# Altium schematic sheet QCLogic Rev A Sht3 GPS.SchDoc
size A4
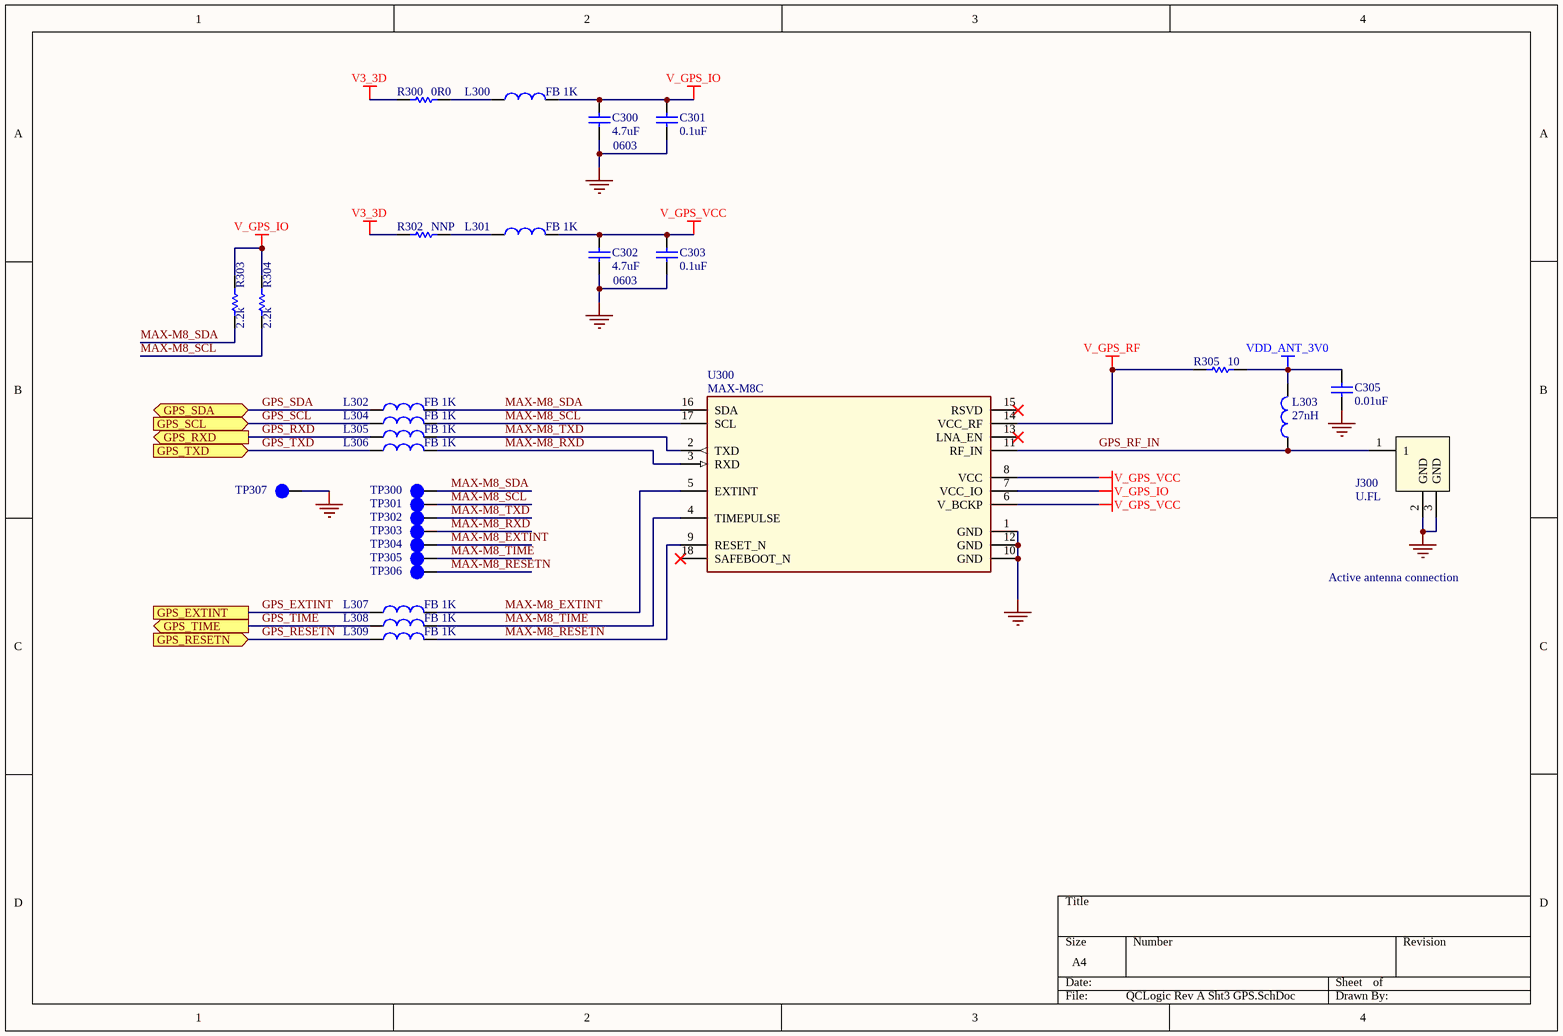
[diagram p0: QCLogic Rev A Sht3 GPS.SchDoc]

## Parts
C300  4.7uF  4. Package: 0603  [SMD CAP 0603]
C301  0.1uF  [SMD CAP 0402]
C302  4.7uF  4. Package: 0603  [SMD CAP 0603]
C303  0.1uF  [SMD CAP 0402]
C305  0.01uF  [SMD CAP 0402]
J300  U.FL  [U.FL]
L300  FB 1K  [SMD RES 0402]
L301  FB 1K  [SMD RES 0402]
L302  FB 1K  [SMD RES 0402]
L303  27nH  [SMD RES 0402]
L304  FB 1K  [SMD RES 0402]
L305  FB 1K  [SMD RES 0402]
L306  FB 1K  [SMD RES 0402]
L307  FB 1K  [SMD RES 0402]
L308  FB 1K  [SMD RES 0402]
L309  FB 1K  [SMD RES 0402]
R300  0R0  [SMD RES 0402]
R302  NNP  [SMD RES 0402]  (no BOM)
R303  2.2k  [SMD RES 0402]
R304  2.2k  [SMD RES 0402]
R305  10  [SMD RES 0402]
TP300  TESTPOINT SMD  [TESTPOINT 0.5mm DIA]  (value not drawn)  (no BOM)
TP301  TESTPOINT SMD  [TESTPOINT 0.5mm DIA]  (value not drawn)  (no BOM)
TP302  TESTPOINT SMD  [TESTPOINT 0.5mm DIA]  (value not drawn)  (no BOM)
TP303  TESTPOINT SMD  [TESTPOINT 0.5mm DIA]  (value not drawn)  (no BOM)
TP304  TESTPOINT SMD  [TESTPOINT 0.5mm DIA]  (value not drawn)  (no BOM)
TP305  TESTPOINT SMD  [TESTPOINT 0.5mm DIA]  (value not drawn)  (no BOM)
TP306  TESTPOINT SMD  [TESTPOINT 0.5mm DIA]  (value not drawn)  (no BOM)
TP307  TESTPOINT SMD  [TESTPOINT 1mm DIA]  (value not drawn)  (no BOM)
U300  MAX-M8C  [MAX-M8]

## Ports
GPS_EXTINT, GPS_RESETN (in), GPS_RXD (out), GPS_SCL (in), GPS_SDA (bidir), GPS_TIME (out), GPS_TXD (in)

## Nets
GND: C300.2 C301.1 C302.2 C303.1 C305.2 J300.2(GND) J300.3(GND) TP307.1 U300.1(GND) U300.10(GND) U300.12(GND)
V3_3D: R300.1 R302.1
V_GPS_IO: C300.1 C301.2 L300.2 R303.1 R304.1 U300.7(VCC_IO)
V_GPS_RF: R305.1 U300.14(VCC_RF)
V_GPS_VCC: C302.1 C303.2 L301.2 U300.6(V_BCKP) U300.8(VCC)
VDD_ANT_3V0: C305.1 L303.2 R305.2
GPS_EXTINT: L307.1 ; port GPS_EXTINT
GPS_RESETN: L309.1 ; port GPS_RESETN
GPS_RF_IN: J300.1 L303.1 U300.11(RF_IN)
GPS_RXD: L305.1 ; port GPS_RXD
GPS_SCL: L304.1 ; port GPS_SCL
GPS_SDA: L302.1 ; port GPS_SDA
GPS_TIME: L308.1 ; port GPS_TIME
GPS_TXD: L306.1 ; port GPS_TXD
MAX-M8_EXTINT: L307.2 TP304.1 U300.5(EXTINT)
MAX-M8_RESETN: L309.2 TP306.1 U300.9(RESET_N)
MAX-M8_RXD: L306.2 TP303.1 U300.3(RXD)
MAX-M8_SCL: L304.2 R304.2 TP301.1 U300.17(SCL)
MAX-M8_SDA: L302.2 R303.2 TP300.1 U300.16(SDA)
MAX-M8_TIME: L308.2 TP305.1 U300.4(TIMEPULSE)
MAX-M8_TXD: L305.2 TP302.1 U300.2(TXD)
NetL300_1: L300.1 R300.2
NetL301_1: L301.1 R302.2

Not connected (* = marked no-connect by the designer): U300 13(LNA_EN)* 15(RSVD)* 18(SAFEBOOT_N)*

## Notes on the sheet
- Active antenna connection

## Library data of the parts
C300 C302 = CAP MLCC SMD: CAP CER 4.7UF 16V X7S 0603; 1. Manufacturer: Murata Electronics; 2. Manufacturer Part Number: GRM188C71C475KE21D; 3. Date Modified: 20200906
C301 C303 = CAP MLCC SMD: CAP CER 0.1UF 25V X7R 0402; 1. Manufacturer: Yageo; 2. Manufacturer Part Number: CC0402KRX7R8BB104; 4. Package: 0402; 3. Date Modified: 20201122
C305 = CAP MLCC SMD: CAP CER 10000PF 16V X7R 0402; 1. Manufacturer: Walsin Technology Corporation; 2. Manufacturer Part Number: 0402B103K160CT; 4. Package: 0402; 3. Date Modified: 20201122
J300 = CONN UMCC MICRO-COAX RECEPTACLE, GEN: 1. Manufacturer: TE Connectivity AMP Connectors; 2. Manufacturer Part Number: 2337019-1; 3. Date Modified: 20201122
L300-L302 L304-L309 = INDUCTOR: FERRITE BEAD 1 KOHM 0402 1LN; 1. Manufacturer: Murata Electronics; 2. Manufacturer Part Number: BLM15HD102SN1D; 3. Date Modified: 20201122
L303 = INDUCTOR: IND 27NH 350MA 460 MOHM; 1. Manufacturer: Murata Electronics; 2. Manufacturer Part Number: LQG15HS27NJ02D; 3. Date Modified: 20201122
R300 R302 = RES SMD: RES SMD 0 OHM JUMPER 1/16W 0402; 1. Manufacturer: Yageo; 2. Manufacturer Part Number: RC0402FR-070RL; 4. Package: 0402; 3. Date Modified: 20201122
R303 R304 = RES SMD: RES SMD 2.2K OHM 1% 1/16W 0402; 1. Manufacturer: Yageo; 2. Manufacturer Part Number: RC0402FR-072K2L; 4. Package: 0402; 3. Date Modified: 20201126
R305 = RES SMD: RES SMD 10 OHM 5% 1/16W 0402; 1. Manufacturer: Yageo; 2. Manufacturer Part Number: RC0402JR-0710RL; 4. Package: 0402; 3. Date Modified: 20200906
TP300-TP307 = TESTPOINT PAD: TESTPOINT SMD PAD; 1. Manufacturer: *; 2. Manufacturer Part Number: *; 3. Date Modified: *
U300 = MODULE RF RCVR GNSS/GPS 1.575GHZ 18LCC: 1. Manufacturer: U-Blox; 2. Manufacturer Part Number: MAX-M8C-0; 3. Date Modified: 20201122